# Altium project ETRX_Shield.PrjPcb (part 3 of 3)
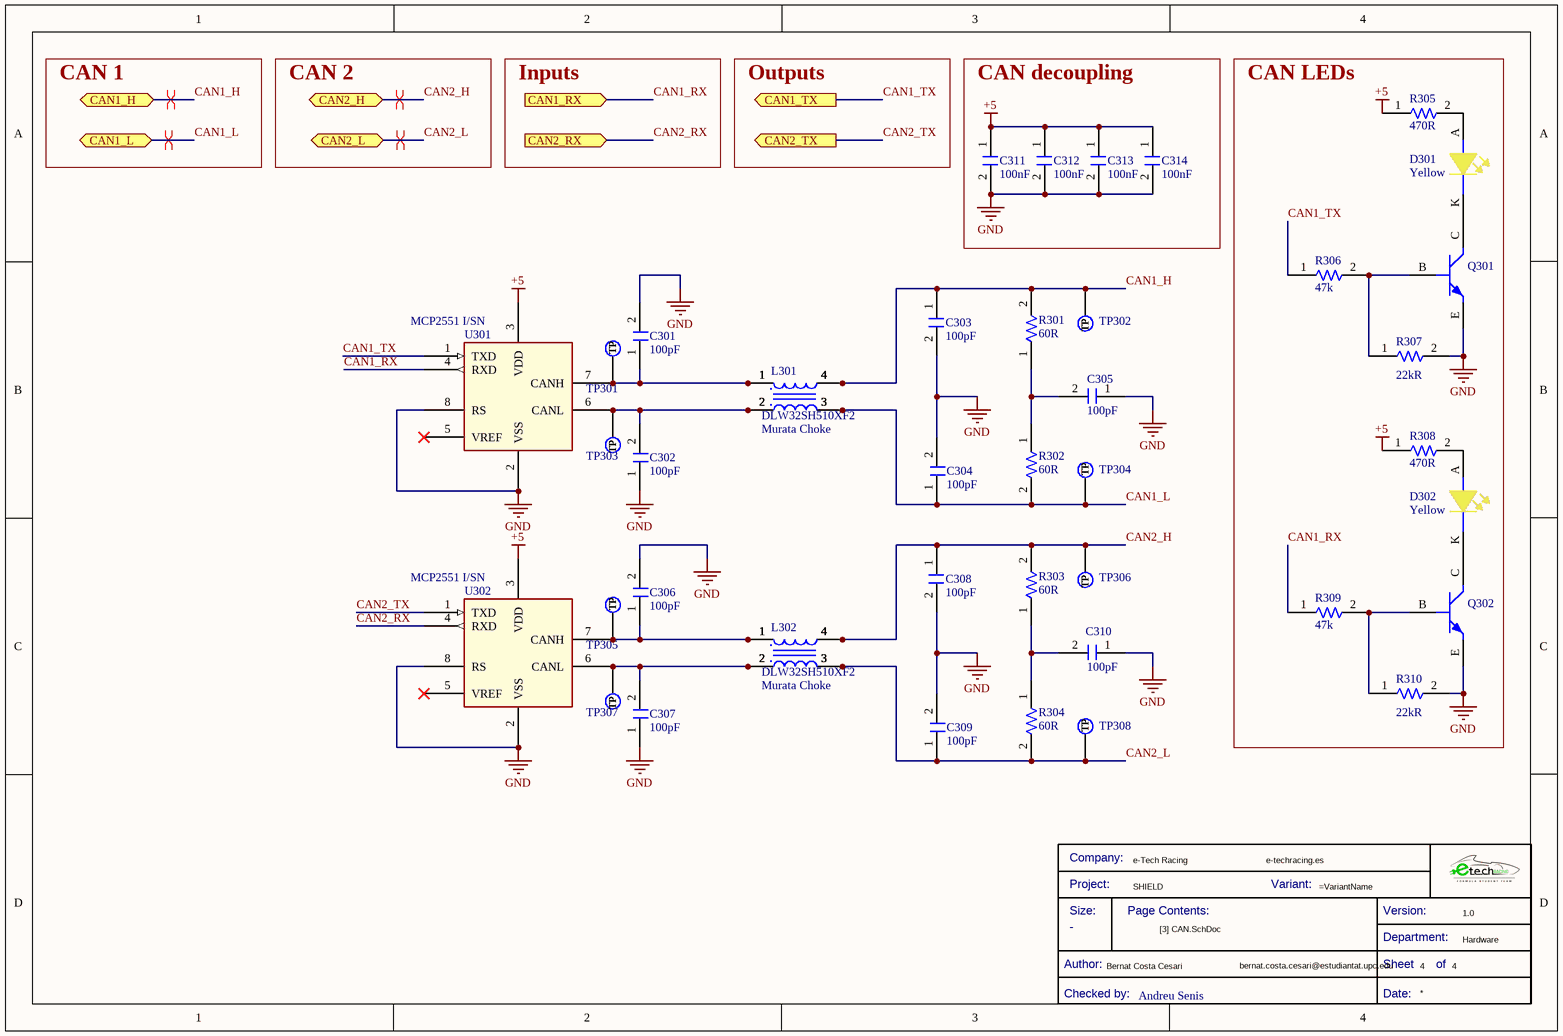
[diagram p4: [3] CAN.SchDoc]

## Nets that join several sheets
+3.3: ETRX_Shield (13 pins), [1] Supply (C105.2 R102.1 U101.2 U101.4), [2] MCU (15 pins)
+5: ETRX_Shield (7 pins), [1] Supply (C104.1 J101.2 R101.1 U101.3), [3] CAN (8 pins)
GND: ETRX_Shield (25 pins), [1] Supply (15 pins), [2] MCU (27 pins), [3] CAN (22 pins)
LV+ in: ETRX_Shield (J1.1), [1] Supply (D101.2 D102.A TP101.1)
CAN1_H: ETRX_Shield (J1.2 J7.1), [3] CAN (C303.1 L301.4 R301.2 TP302.1)
CAN1_L: ETRX_Shield (J1.3 J7.3), [3] CAN (C304.1 L301.3 R302.2 TP304.1)
CAN1_RX: [2] MCU (U201.81), [3] CAN (R309.1 U301.4)
CAN1_TX: [2] MCU (U201.82), [3] CAN (R306.1 U301.1)
CAN2_H: ETRX_Shield (J1.4 J6.27), [3] CAN (C308.1 L302.4 R303.2 TP306.1)
CAN2_L: ETRX_Shield (J1.5 J6.25), [3] CAN (C309.1 L302.3 R304.2 TP308.1)
CAN2_RX: [2] MCU (U201.51), [3] CAN (U302.4)
CAN2_TX: [2] MCU (U201.52), [3] CAN (U302.1)
LED_PA2: ETRX_Shield (J4.8), [2] MCU (R210.2 U201.24)
LED_PA3: ETRX_Shield (J4.6), [2] MCU (R208.2 U201.25)
LED_PA4: ETRX_Shield (J4.4), [2] MCU (R207.2 U201.28)
LV tr: ETRX_Shield (J7.5 J7.7 J7.9), [1] Supply (C102.1 F101.1 L101.2 TP102.1)
NRST: ETRX_Shield (5 pins), [2] MCU (U201.14)
PA0: ETRX_Shield (J4.12), [2] MCU (U201.22)
PA1: ETRX_Shield (J4.10), [2] MCU (U201.23)
PA5: ETRX_Shield (J4.2), [2] MCU (U201.29)
PA6: ETRX_Shield (J4.3), [2] MCU (U201.30)
PA7: ETRX_Shield (J4.1), [2] MCU (U201.31)
PA8: ETRX_Shield (J6.4), [2] MCU (U201.67)
PA9: ETRX_Shield (J6.2), [2] MCU (U201.68)
PA10: ETRX_Shield (J6.7), [2] MCU (U201.69)
PA15: ETRX_Shield (J7.28), [2] MCU (U201.77)
PB0: ETRX_Shield (J5.1), [2] MCU (U201.34)
PB1: ETRX_Shield (J5.3), [2] MCU (U201.35)
PB2: ETRX_Shield (J5.5), [2] MCU (U201.36)
PB3: ETRX_Shield (J3.6 J7.20), [2] MCU (U201.89)
PB4: ETRX_Shield (J7.18), [2] MCU (U201.90)
PB5: ETRX_Shield (J7.16), [2] MCU (U201.91)
PB6: ETRX_Shield (J7.14), [2] MCU (U201.92)
PB7: ETRX_Shield (J7.12), [2] MCU (U201.93)
PB8: ETRX_Shield (J7.10), [2] MCU (U201.95)
PB9: ETRX_Shield (J7.8), [2] MCU (U201.96)
PB10: ETRX_Shield (J5.25), [2] MCU (U201.46)
PB11: ETRX_Shield (J5.27), [2] MCU (U201.47)
PB14: ETRX_Shield (J6.28), [2] MCU (U201.53)
PB15: ETRX_Shield (J6.26), [2] MCU (U201.54)
PC0: ETRX_Shield (J4.20), [2] MCU (U201.15)
PC1: ETRX_Shield (J4.18), [2] MCU (U201.16)
PC2: ETRX_Shield (J4.16), [2] MCU (U201.17)
PC3: ETRX_Shield (J4.14), [2] MCU (U201.18)
PC4: ETRX_Shield (J5.4), [2] MCU (U201.32)
PC5: ETRX_Shield (J5.6), [2] MCU (U201.33)
PC6: ETRX_Shield (J6.12), [2] MCU (U201.63)
PC7: ETRX_Shield (J6.10), [2] MCU (U201.64)
PC8: ETRX_Shield (J6.8), [2] MCU (U201.65)
PC9: ETRX_Shield (J6.6), [2] MCU (U201.66)
PC10: ETRX_Shield (J7.26), [2] MCU (U201.78)
PC11: ETRX_Shield (J7.24), [2] MCU (U201.79)
PC12: ETRX_Shield (J7.22), [2] MCU (U201.80)
PC13: ETRX_Shield (J4.24), [2] MCU (U201.7)
PC14: ETRX_Shield (J4.22), [2] MCU (U201.8)
PC15: ETRX_Shield (J4.23), [2] MCU (U201.9)
PD2: ETRX_Shield (J7.21), [2] MCU (U201.83)
PD3: ETRX_Shield (J7.19), [2] MCU (U201.84)
PD4: ETRX_Shield (J7.17), [2] MCU (U201.85)
PD5: ETRX_Shield (J7.15), [2] MCU (U201.86)
PD6: ETRX_Shield (J7.13), [2] MCU (U201.87)
PD7: ETRX_Shield (J7.11), [2] MCU (U201.88)
PD8: ETRX_Shield (J6.24), [2] MCU (U201.55)
PD9: ETRX_Shield (J6.22), [2] MCU (U201.56)
PD10: ETRX_Shield (J6.20), [2] MCU (U201.57)
PD11: ETRX_Shield (J6.18), [2] MCU (U201.58)
PD12: ETRX_Shield (R3.2 U1.6), [2] MCU (U201.59)
PD13: ETRX_Shield (R2.2 U1.5), [2] MCU (U201.60)
PD14: ETRX_Shield (J6.16), [2] MCU (U201.61)
PD15: ETRX_Shield (J6.14), [2] MCU (U201.62)
PE0: ETRX_Shield (J7.6), [2] MCU (U201.97)
PE1: ETRX_Shield (J7.4), [2] MCU (U201.98)
PE2: ETRX_Shield (J4.28), [2] MCU (U201.1)
PE3: ETRX_Shield (J4.27), [2] MCU (U201.2)
PE5: ETRX_Shield (J4.26), [2] MCU (U201.4)
PE6: ETRX_Shield (J4.25), [2] MCU (U201.5)
PE7: ETRX_Shield (J5.7), [2] MCU (U201.37)
PE8: ETRX_Shield (J5.9), [2] MCU (U201.38)
PE9: ETRX_Shield (J5.11), [2] MCU (U201.39)
PE10: ETRX_Shield (J5.13), [2] MCU (U201.40)
PE11: ETRX_Shield (J5.15), [2] MCU (U201.41)
PE12: ETRX_Shield (J5.17), [2] MCU (U201.42)
PE13: ETRX_Shield (J5.19), [2] MCU (U201.43)
PE14: ETRX_Shield (J5.21), [2] MCU (U201.44)
PE15: ETRX_Shield (J5.23), [2] MCU (U201.45)
SWCLK: ETRX_Shield (J3.2), [2] MCU (U201.76)
SWDIO: ETRX_Shield (J3.4), [2] MCU (U201.72)
USB5V: ETRX_Shield (J2.1), [1] Supply (6 pins)
USB_OTG_H: ETRX_Shield (J2.3), [2] MCU (D201.1 R203.1 TP201.1 U201.71)
USB_OTG_L: ETRX_Shield (J2.2), [2] MCU (D202.1 TP202.1 U201.70)